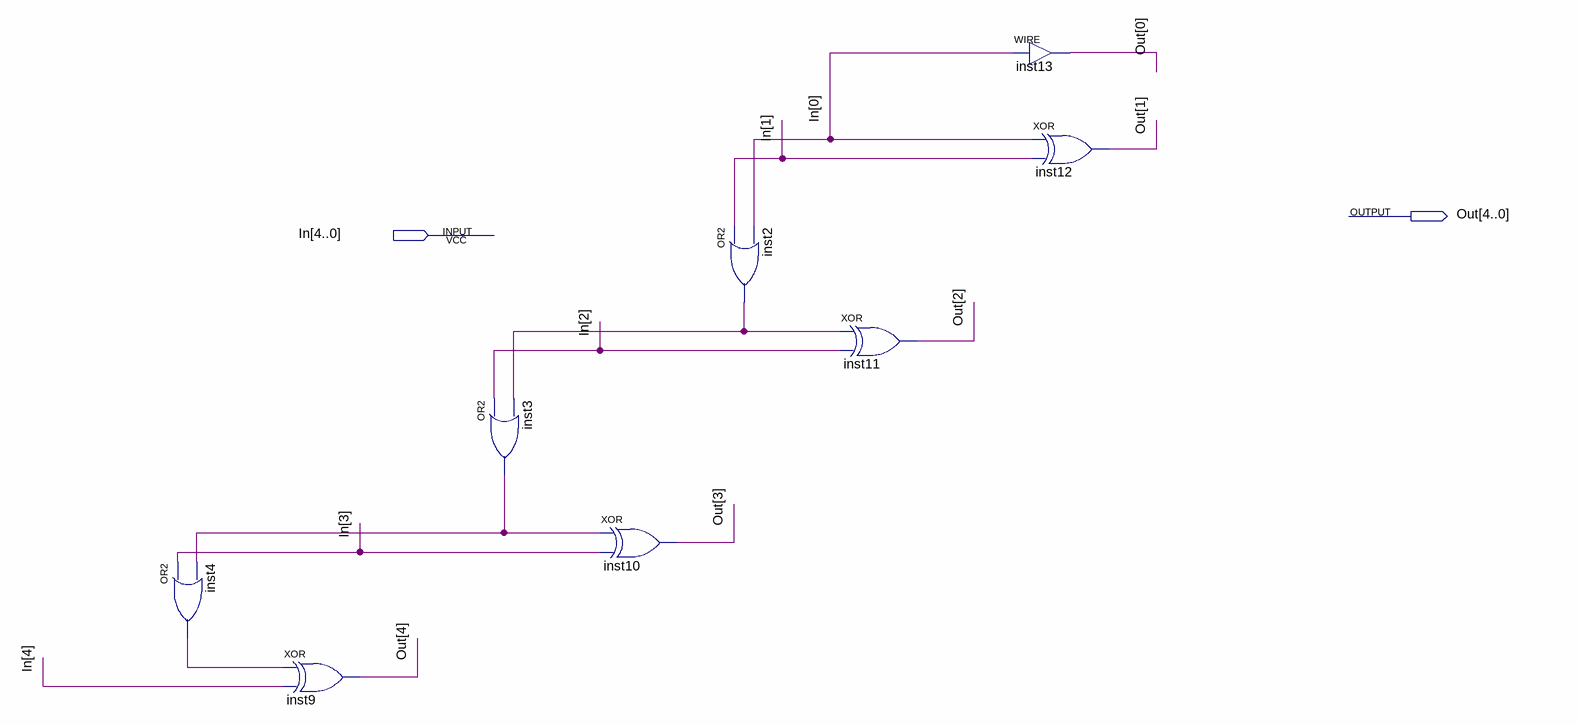
[diagram p0: schematic sheet]
// Quartus schematic C5.bdf as structural Verilog: 8 symbols, 2 pins
module C5 (
  input  [4:0] In,
  output [4:0] Out
);

  wire inst2_out, inst3_out, inst4_out;

  or inst4 (inst4_out, In[3], inst3_out);
  xor inst9 (Out[4], inst4_out, In[4]);
  or inst3 (inst3_out, In[2], inst2_out);
  xor inst10 (Out[3], inst3_out, In[3]);
  or inst2 (inst2_out, In[1], In[0]);
  xor inst11 (Out[2], inst2_out, In[2]);
  assign Out[0] = In[0];  // WIRE inst13
  xor inst12 (Out[1], In[0], In[1]);
endmodule
